# Altium schematic sheet Sheet3.SchDoc
size A4
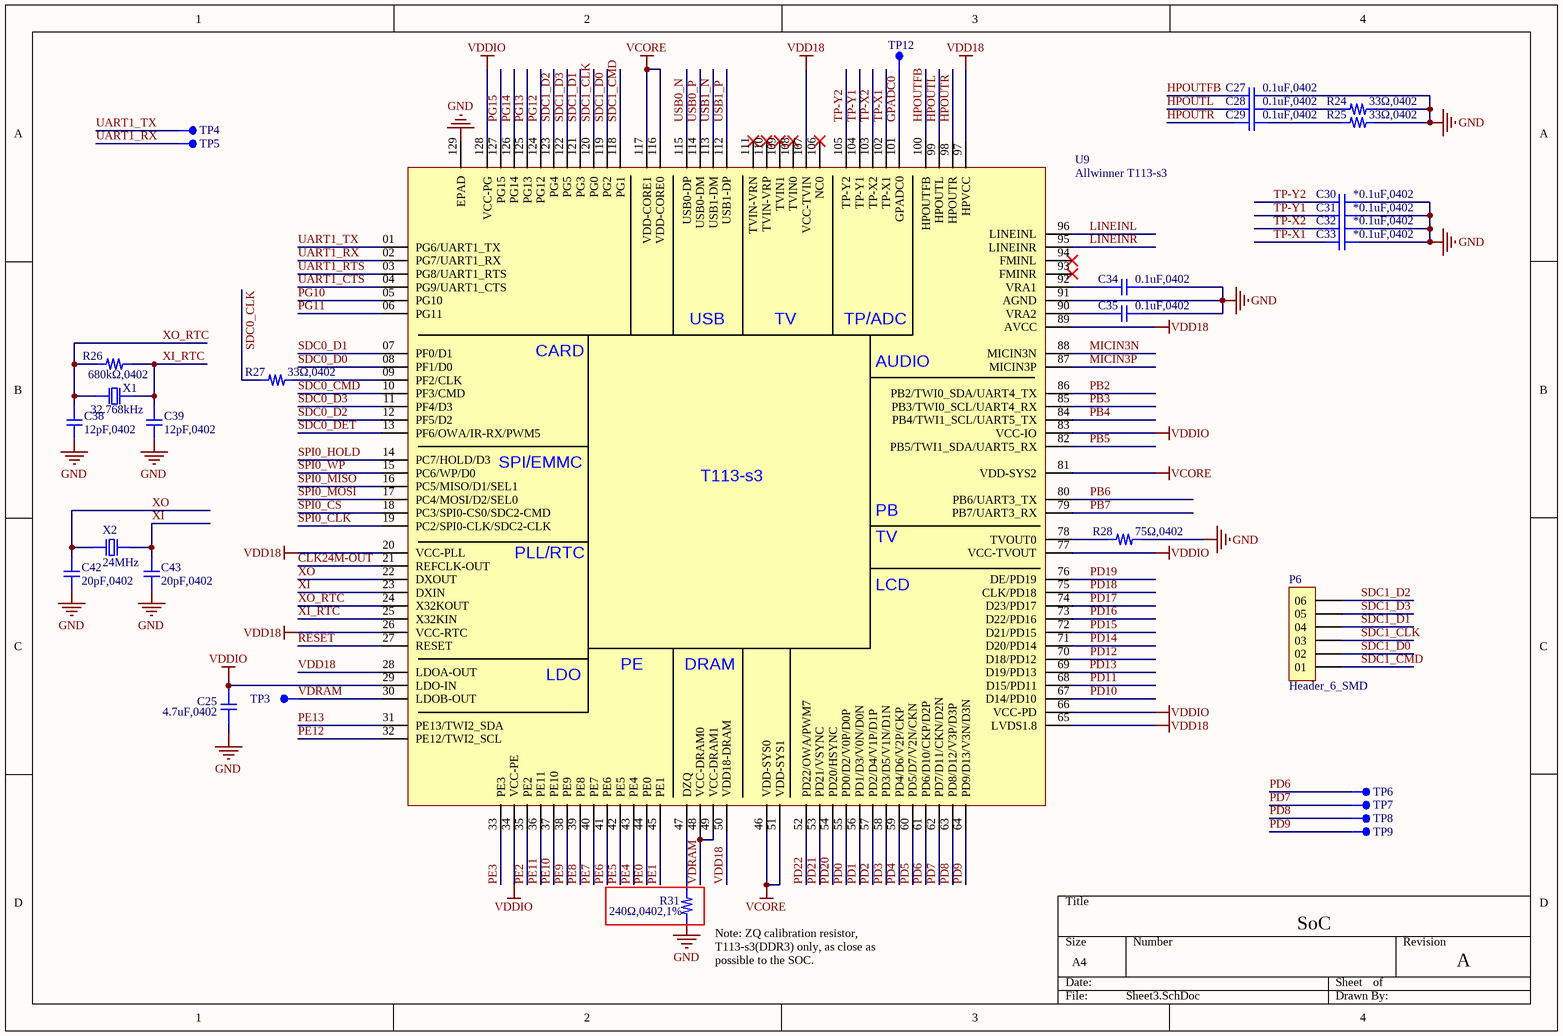
[diagram p0: Sheet3.SchDoc]

## Parts
C25  4.7uF,0402  [C0402]
C27  0.1uF,0402  [C0402]
C28  0.1uF,0402  [C0402]
C29  0.1uF,0402  [C0402]
C30  *0.1uF,0402  [C0402]
C31  *0.1uF,0402  [C0402]
C32  *0.1uF,0402  [C0402]
C33  *0.1uF,0402  [C0402]
C34  0.1uF,0402  [C0402]
C35  0.1uF,0402  [C0402]
C38  12pF,0402  [C0402]
C39  12pF,0402  [C0402]
C42  20pF,0402  [C0402]
C43  20pF,0402  [C0402]
P6  Header_6_SMD  [HEADER_6_SMD]
R24  33Ω,0402  [R0402]
R25  33Ω,0402  [R0402]
R26  680kΩ,0402  [R0402]
R27  33Ω,0402  [R0402]
R28  75Ω,0402  [R0402]
R31  240Ω,0402,1%  [R0402]
TP3  TP  [TP]  (value not drawn)
TP4  TP  [TP]  (value not drawn)
TP5  TP  [TP]  (value not drawn)
TP6  TP  [TP]  (value not drawn)
TP7  TP  [TP]  (value not drawn)
TP8  TP  [TP]  (value not drawn)
TP9  TP  [TP]  (value not drawn)
TP12  TP  [TP]  (value not drawn)
U9  Allwinner T113-s3  [eLQFP128]
X1  32.768kHz  [XTAL_3215_32.768KHz]
X2  24MHz  [XTAL_SMD_3225]

## Nets
GND: C25.01 C27.01 C30.01 C31.01 C32.01 C33.01 C34.01 C35.01 C38.02 C39.02 C42.02 C43.02 R24.01 R25.01 R28.01 R31.02 U9.91(AGND) U9.129(EPAD)
VCORE: U9.46(VDD-SYS0) U9.51(VDD-SYS1) U9.81(VDD-SYS2) U9.116(VDD-CORE0) U9.117(VDD-CORE1)
VDD18: U9.20(VCC-PLL) U9.26(VCC-RTC) U9.28(LDOA-OUT) U9.50(VDD18-DRAM) U9.65(LVDS1.8) U9.89(AVCC) U9.97(HPVCC) U9.107(VCC-TVIN)
VDDIO: C25.02 U9.29(LDO-IN) U9.34(VCC-PE) U9.66(VCC-PD) U9.77(VCC-TVOUT) U9.83(VCC-IO) U9.128(VCC-PG)
CLK24M-OUT: U9.21(REFCLK-OUT)
GPADC0: TP12.01 U9.101(GPADC0)
HPOUTFB: C27.02 U9.100(HPOUTFB)
HPOUTL: C28.02 U9.99(HPOUTL)
HPOUTR: C29.02 U9.98(HPOUTR)
LINEINL: U9.96(LINEINL)
LINEINR: U9.95(LINEINR)
MICIN3N: U9.88(MICIN3N)
MICIN3P: U9.87(MICIN3P)
PB2: U9.86(PB2/TWI0_SDA/UART4_TX)
PB3: U9.85(PB3/TWI0_SCL/UART4_RX)
PB4: U9.84(PB4/TWI1_SCL/UART5_TX)
PB5: U9.82(PB5/TWI1_SDA/UART5_RX)
PB6: U9.80(PB6/UART3_TX)
PB7: U9.79(PB7/UART3_RX)
PD0: U9.55(PD0/D2/V0P/D0P)
PD1: U9.56(PD1/D3/V0N/D0N)
PD2: U9.57(PD2/D4/V1P/D1P)
PD3: U9.58(PD3/D5/V1N/D1N)
PD4: U9.59(PD4/D6/V2P/CKP)
PD5: U9.60(PD5/D7/V2N/CKN)
PD6: TP6.01 U9.61(PD6/D10/CKP/D2P)
PD7: TP7.01 U9.62(PD7/D11/CKN/D2N)
PD8: TP8.01 U9.63(PD8/D12/V3P/D3P)
PD9: TP9.01 U9.64(PD9/D13/V3N/D3N)
PD10: U9.67(D14/PD10)
PD11: U9.68(D15/PD11)
PD12: U9.70(D18/PD12)
PD13: U9.69(D19/PD13)
PD14: U9.71(D20/PD14)
PD15: U9.72(D21/PD15)
PD16: U9.73(D22/PD16)
PD17: U9.74(D23/PD17)
PD18: U9.75(CLK/PD18)
PD19: U9.76(DE/PD19)
PD20: U9.54(PD20/HSYNC)
PD21: U9.53(PD21/VSYNC)
PD22: U9.52(PD22/OWA/PWM7)
PE0: U9.44(PE0)
PE1: U9.45(PE1)
PE2: U9.35(PE2)
PE3: U9.33(PE3)
PE4: U9.43(PE4)
PE5: U9.42(PE5)
PE6: U9.41(PE6)
PE7: U9.40(PE7)
PE8: U9.39(PE8)
PE9: U9.38(PE9)
PE10: U9.37(PE10)
PE11: U9.36(PE11)
PE12: U9.32(PE12/TWI2_SCL)
PE13: U9.31(PE13/TWI2_SDA)
PG10: U9.05(PG10)
PG11: U9.06(PG11)
PG12: U9.124(PG12)
PG13: U9.125(PG13)
PG14: U9.126(PG14)
PG15: U9.127(PG15)
RESET: U9.27(RESET)
SDC0_CLK: R27.02
SDC0_CMD: U9.10(PF3/CMD)
SDC0_D0: U9.08(PF1/D0)
SDC0_D1: U9.07(PF0/D1)
SDC0_D2: U9.12(PF5/D2)
SDC0_D3: U9.11(PF4/D3)
SDC0_DET: U9.13(PF6/OWA/IR-RX/PWM5)
SDC1_CLK: P6.03 U9.120(PG0)
SDC1_CMD: P6.01 U9.118(PG1)
SDC1_D0: P6.02 U9.119(PG2)
SDC1_D1: P6.04 U9.121(PG3)
SDC1_D2: P6.06 U9.123(PG4)
SDC1_D3: P6.05 U9.122(PG5)
SPI0_CLK: U9.19(PC2/SPI0-CLK/SDC2-CLK)
SPI0_CS: U9.18(PC3/SPI0-CS0/SDC2-CMD)
SPI0_HOLD: U9.14(PC7/HOLD/D3)
SPI0_MISO: U9.16(PC5/MISO/D1/SEL1)
SPI0_MOSI: U9.17(PC4/MOSI/D2/SEL0)
SPI0_WP: U9.15(PC6/WP/D0)
TP-X1: C33.02 U9.102(TP-X1)
TP-X2: C32.02 U9.103(TP-X2)
TP-Y1: C31.02 U9.104(TP-Y1)
TP-Y2: C30.02 U9.105(TP-Y2)
UART1_CTS: U9.04(PG9/UART1_CTS)
UART1_RTS: U9.03(PG8/UART1_RTS)
UART1_RX: TP5.01 U9.02(PG7/UART1_RX)
UART1_TX: TP4.01 U9.01(PG6/UART1_TX)
USB0_N: U9.115(USB0-DP)
USB0_P: U9.114(USB0-DM)
USB1_N: U9.113(USB1-DM)
USB1_P: U9.112(USB1-DP)
VDRAM: TP3.01 U9.30(LDOB-OUT) U9.48(VCC-DRAM0) U9.49(VCC-DRAM1)
XI: C43.01 U9.23(DXIN) X2.01
XI_RTC: C39.01 R26.01 U9.25(X32KIN) X1.01
XO: C42.01 U9.22(DXOUT) X2.02
XO_RTC: C38.01 R26.02 U9.24(X32KOUT) X1.02
NetC28_01: C28.01 R24.02
NetC29_01: C29.01 R25.02
NetC34_02: C34.02 U9.92(VRA1)
NetC35_02: C35.02 U9.90(VRA2)
NetR27_01: R27.01 U9.09(PF2/CLK)
NetR28_02: R28.02 U9.78(TVOUT0)
NetR31_01: R31.01 U9.47(DZQ)

Not connected (* = marked no-connect by the designer): U9 93(FMINR)* 94(FMINL)* 106(NC0)* 108(TVIN0)* 109(TVIN1)* 110(TVIN-VRP)* 111(TVIN-VRN)*

## Notes on the sheet
- (near R31) Note: ZQ calibration resistor, T113-s3(DDR3) only, as close as possible to the SOC.
- SoC
- A
- (in symbol Allwinner T113-s3) USB; TV; TP/ADC; CARD; AUDIO; SPI/EMMC; T113-s3; PB; PLL/RTC; LCD; PE; DRAM; LDO

## Library data of the parts
C25 C27-C35 C38 C39 C42 C43 = Cap
P6 = Header_6
R24-R28 R31 = Res
X1 X2 = XTAL